# Altium schematic sheet OPLink Mini.SchDoc: OPLink Mini
size A3; Author: D. Ankers; CompanyName: The OpenPilot Project; DrawnBy: D. Ankers; Engineer: D. Ankers; Organization: The OpenPilot Project; DocumentNumber: 1; Revision: A; SheetNumber: 1; SheetTotal: 1; License: Creative Commons BY NC SA; DocumentName: OPLink Mini; ProjectName: OPLink Mini
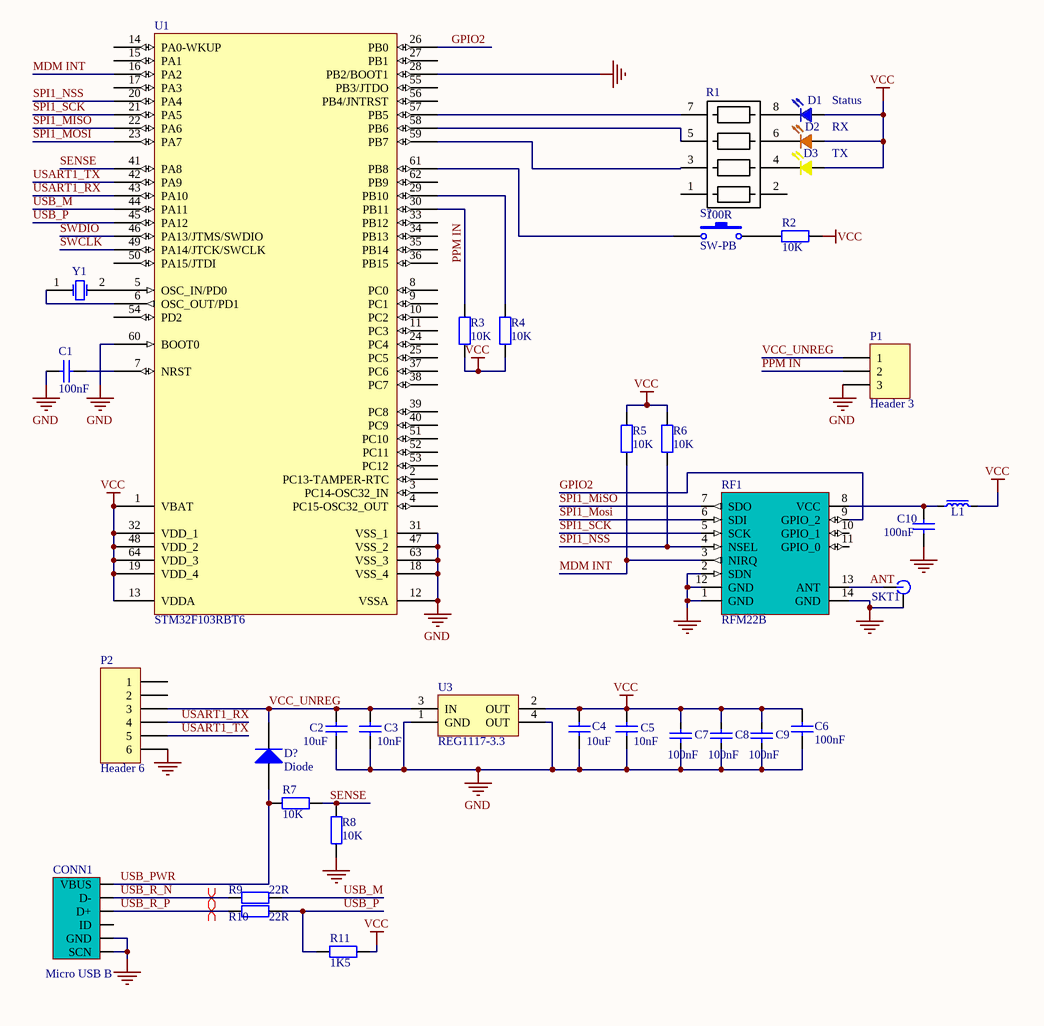
[diagram p0: OPLink Mini.SchDoc]

## Parts
C1  value 100nF  [0402x]  (hidden comment: Cap402)
C2  value 10uF  [CAP805L]  (hidden comment: Cap805)
C3  value 10nF  [CAP402N]  (hidden comment: 10n)
C4  value 10uF  [CAP805L]  (hidden comment: Cap805)
C5  value 10nF  [CAP402N]  (hidden comment: 10n)
C6  value 100nF  [CAP402N]  (hidden comment: Cap402)
C7  value 100nF  [CAP402N]  (hidden comment: Cap402)
C8  value 100nF  [CAP402N]  (hidden comment: Cap402)
C9  value 100nF  [CAP402N]  (hidden comment: Cap402)
C10  value 100nF  [0805x]  (hidden comment: Cap402)
CONN1  Micro USB B  [Micro_USB]
D1  Status  [LED603N]
D2  RX  [LED603N]
D3  TX  [LED603N]
D?  Diode  [SMA]
L1  300mA  [1206x]  (value not drawn)
P1  Header 3  [HDR1X3]
P2  Header 6  [HDR1X6]
R1  100R  [RES_ARRAY_4X]
R2  value 10K  [1206x]  (hidden comment: Res402)
R3  value 10K  [0402x]  (hidden comment: Res402)
R4  value 10K  [0402x]  (hidden comment: Res402)
R5  value 10K  [RES402N]  (hidden comment: Res402)
R6  value 10K  [RES402N]  (hidden comment: Res402)
R7  value 10K  [0805x]  (hidden comment: Res402)
R8  value 10K  [0805x]  (hidden comment: Res402)
R9  value 22R  [RES402N]  (hidden comment: Res402)
R10  value 22R  [RES402N]  (hidden comment: Res402)
R11  value 1K5  [RES402N]  (hidden comment: Res402)
RF1  RFM22B  [RFM22B]
S?  SW-PB  [BTN_STD]
SKT1  MMCX Thru hole  [SMA_CORNER]  (value not drawn)
U1  STM32F103RBT6  [LQFP64_N]
U3  REG1117-3.3  [ZZ311]
Y1  XTAL  [CRYSTAL]  (value not drawn)

## Nets
GND: C1.1 C2.2 C3.2 C4.2 C5.2 C6.2 C7.2 C8.2 C9.2 C10.2 CONN1.0(SCN) CONN1.5(GND) P1.3 P2.6 R8.2 RF1.1(N.C) RF1.2(SDN) RF1.12(GND) RF1.14(N.C) SKT1.2(GND) U1.12(VSSA) U1.18(VSS_4) U1.28(PB2/BOOT1) U1.31(VSS_1) U1.47(VSS_2) U1.60(BOOT0) U1.63(VSS_3) U3.1(GND) U3.4(OUT)
VCC: C4.1 C5.1 C6.1 C7.1 C8.1 C9.1 D1.2(A) D2.2(A) D3.2(A) L1.1 R2.2 R3.2 R4.2 R5.1 R6.1 R11.2 U1.1(VBAT) U1.13(VDDA) U1.19(VDD_4) U1.32(VDD_1) U1.48(VDD_2) U1.64(VDD_3) U3.2(OUT)
ANT: RF1.13(ANT) SKT1.1(PIN)
GPIO2: RF1.9(N.C) U1.26(PB0)
MDM INT: R5.2 RF1.3(NIRQ) U1.16(PA2)
PPM IN: P1.2 R3.1 U1.30(PB11)
SENSE: R7.1 R8.1 U1.41(PA8)
SPI1_MiSO: RF1.7(SDO) U1.22(PA6)
SPI1_Mosi: RF1.6(SDI) U1.23(PA7)
SPI1_NSS: R6.2 RF1.4(N.C) U1.20(PA4)
SPI1_SCK: RF1.5(SCK) U1.21(PA5)
SWCLK: U1.49(PA14/JTCK/SWCLK)
SWDIO: U1.46(PA13/JTMS/SWDIO)
USART1_RX: P2.4 U1.43(PA10)
USART1_TX: P2.5 U1.42(PA9)
USB_M: R9.1 U1.44(PA11)
USB_P: R10.1 R11.1 U1.45(PA12)
USB_PWR: CONN1.1(VBUS) D?.1(A) R7.2
USB_R_N: CONN1.2(D-) R9.2
USB_R_P: CONN1.3(D+) R10.2
VCC_UNREG: C2.1 C3.1 D?.2(K) P1.1 P2.3 U3.3(IN)
NetC1_2: C1.2 U1.7(NRST)
NetC10_1: C10.1 L1.2 RF1.8(N.C)
NetD1_1: D1.1(K) R1.8
NetD2_1: D2.1(K) R1.6
NetD3_1: D3.1(K) R1.4
NetR1_3: R1.3 U1.59(PB7)
NetR1_5: R1.5 U1.58(PB6)
NetR1_7: R1.7 U1.57(PB5)
NetR2_1: R2.1 S?.2
NetR4_1: R4.1 U1.29(PB10)
NetS?_1: S?.1 U1.61(PB8)
NetU1_5: U1.5(OSC_IN/PD0) Y1.2(OSC2)
NetU1_6: U1.6(OSC_OUT/PD1) Y1.1(OSC1)

Not connected (* = marked no-connect by the designer): CONN1 4(ID); P2 1 2; R1 1 2; RF1 10(GPIO_1) 11(GPIO_0); U1 2(PC13-TAMPER-RTC) 3(PC14-OSC32_IN) 4(PC15-OSC32_OUT) 8(PC0) 9(PC1) 10(PC2) 11(PC3) 14(PA0-WKUP) 15(PA1) 17(PA3) 24(PC4) 25(PC5) 27(PB1) 33(PB12) 34(PB13) 35(PB14) 36(PB15) 37(PC6) 38(PC7) 39(PC8) 40(PC9) 50(PA15/JTDI) 51(PC10) 52(PC11) 53(PC12) 54(PD2) 55(PB3/JTDO) 56(PB4/JNTRST) 62(PB9)

## Layout directives
differential pair: USB_R_N, USB_R_P

## Notes on the sheet
- Title
- Size:
- Date:
- A3
- Number:
- Time:
- Revision:
- Sheet
- of
- File:

## Library data of the parts
C1 C3 C5-C10 = Cap402: Capacitor SMD; Published: 1-Nov-2010; LatestRevisionDate: 1-Nov-2010; LatestRevisionNote: Released OpenPilot Lib; PackageReference: 0402 (1005 Metric); Publisher: The OpenPilot Project; ComponentLink2Description: Datasheet; Supplier 1: Digi-Key
  C1 C6-C10: Supplier Part Number 1: 445-4952-1-ND
  C3 C5: Supplier Part Number 1: 587-1223-1-ND
C2 C4 = Cap805: Capacitor SMD; Published: 1-Nov-2010; LatestRevisionDate: 1-Nov-2010; LatestRevisionNote: Released OpenPilot Lib; PackageReference: 0805 (2012 Metric); Publisher: The OpenPilot Project; Supplier 1: Digi-Key; Supplier Part Number 1: 490-3886-1-ND
CONN1 = USB Micro B SMT: USB Micro B SMT Socket; Class: Connector; ComponentLink2Description: Datasheet; LatestRevisionDate: 1-Nov-2010; LatestRevisionNote: Released OpenPilot Lib; Published: 1-Nov-2010; Publisher: The OpenPilot Project; Supplier 1: Digi-Key; Supplier Part Number 1: WM17141CT-ND
D1 = LED 603 Bl: Blue 603 LED; Supplier 1: Digi-Key; Supplier Part Number 1: 350-2037-1-ND
D2 = LED 603 Or: Orange 603 LED; Value: 2.1v 20mA; Supplier 1: Digi-Key; Supplier Part Number 1: 754-1120-1-ND
D3 = LED 603 Yellow: Yellow 603 LED; Value: 2.1v 20mA; ComponentLink2Description: Datasheet; LatestRevisionDate: 1-Nov-2010; LatestRevisionNote: Released OpenPilot Lib; Published: 1-Nov-2010; Publisher: The OpenPilot Project; Supplier 1: Digi-Key; Supplier Part Number 1: 754-1125-1-ND
D? = Diode: Default Diode; Published: 8-Jun-2000; LatestRevisionDate: 17-Jul-2002; LatestRevisionNote: Re-released for DXP Platform.; PackageVersion: Sep-1996; PackageReference: SMC; Publisher: Altium Limited; PackageDescription: DO-214-AB/SMC; 2 C-Bend Leads; Body 7.9 x 5.9 mm, inc. leads (LxW); Code_JEDEC: DO-214-AB
L1 = FerriteBead_300mA: Ferrite Bead 300mA; Manufacturer: Generic Components; Class: Passive; Supplier 1: Digi-Key; Supplier Part Number 1: 587-1739-1-ND
P1 = Header 3: Header, 3-Pin; LatestRevisionDate: 17-Jul-2002; LatestRevisionNote: Re-released for DXP Platform.; Publisher: Altium Limited
P2 = Header 6: Header, 6-Pin; LatestRevisionDate: 17-Jul-2002; LatestRevisionNote: Re-released for DXP Platform.; Publisher: Altium Limited
R1 = RES_Array_4x: 742C0431000FP; Order Number: EXB-38V101JV; Value: RES ARRAY 4 RES 100 OHM 1206; Distributor: Panasonic; Package: 1206 (3216 Metric)
R2-R11 = Res402: Resistor SMD; Published: 1-Nov-2010; LatestRevisionDate: 1-Nov-2010; LatestRevisionNote: Released OpenPilot Lib; PackageReference: 0402 ( 1005 Metric); Publisher: The OpenPilot Project; ComponentLink2Description: Datasheet; Supplier 1: Digi-Key
  R2-R8: Supplier Part Number 1: P10.0KLCT-ND
  R9 R10: Supplier Part Number 1: P22.0LCT-ND
  R11: Supplier Part Number 1: P1.50KLCT-ND
RF1 = RFM22B-S2: UHF 100mW Transceiver
S? = SW-PB: Switch; Published: 24-Mar-1999; LatestRevisionDate: 17-Jul-2002; LatestRevisionNote: Re-released for DXP Platform.; PackageReference: SPST-2; Publisher: Altium Limited; PackageDescription: Switch; 2 Leads
SKT1 = MMCX Thru hole: MMCX Socket; Supplier 1: Digi-Key; Supplier Part Number 1: ARF1729-ND
U1 = STM32F103RBT6: STM32 ARM-based 32-bit MCU with 128 Kbytes Flash, 64-pin LQFP, Industrial Temperature; Published: 30-May-2008; DatasheetVersion: rev6, Mar-2008; PackageVersion: Mar-2008; PackageReference: LQFP64; Publisher: Altium Limited; PackageDescription: 64-Pin Low-Profile Quad Flat Pack, 10 x 10 mm Body, 0.5 mm Pitch (LQFP64); ComponentLink1Description: Manufacturer Link; ComponentLink1URL: www.st.com/stm32; ComponentLink2Description: Datasheet; ComponentLink2URL: http://www.st.com/stonline/products/literature/ds/13587.pdf
U3 = REG1117-3.3: 800mA and 1A Low Dropout Positive Regulator 2.85V, 3.3V, 5V, and Adjustable; Published: 8-Jun-2000; LatestRevisionDate: 17-Jul-2002; LatestRevisionNote: Re-released for DXP Platform.; DatasheetVersion: Sep-1997; PackageVersion: revC; PackageReference: ZZ311; Publisher: Altium Limited; PackageDescription: SOT-223/SC-73; 4 Leads; Body 6.7 x 7.3 mm, inc. leads (LxW max); ComponentLink1Description: Manufacturer Link; ComponentLink1URL: http://www.ti.com/; ComponentLink2Description: Datasheet; ComponentLink2URL: http://www-s.ti.com/sc/ds/REG1117.pdf
Y1 = XTAL: Crystal Oscillator; Published: 8-Jun-2000; LatestRevisionDate: 17-Jul-2002; LatestRevisionNote: Re-released for DXP Platform.; PackageReference: R38; Publisher: Altium Limited; PackageDescription: Crystal, Thru-Hole; 2 Leads; Body 3.1 x 8.2 mm (Dia.xH)